# EAGLE design Sensor_AnalogVideo (EAGLE 9.6.2)
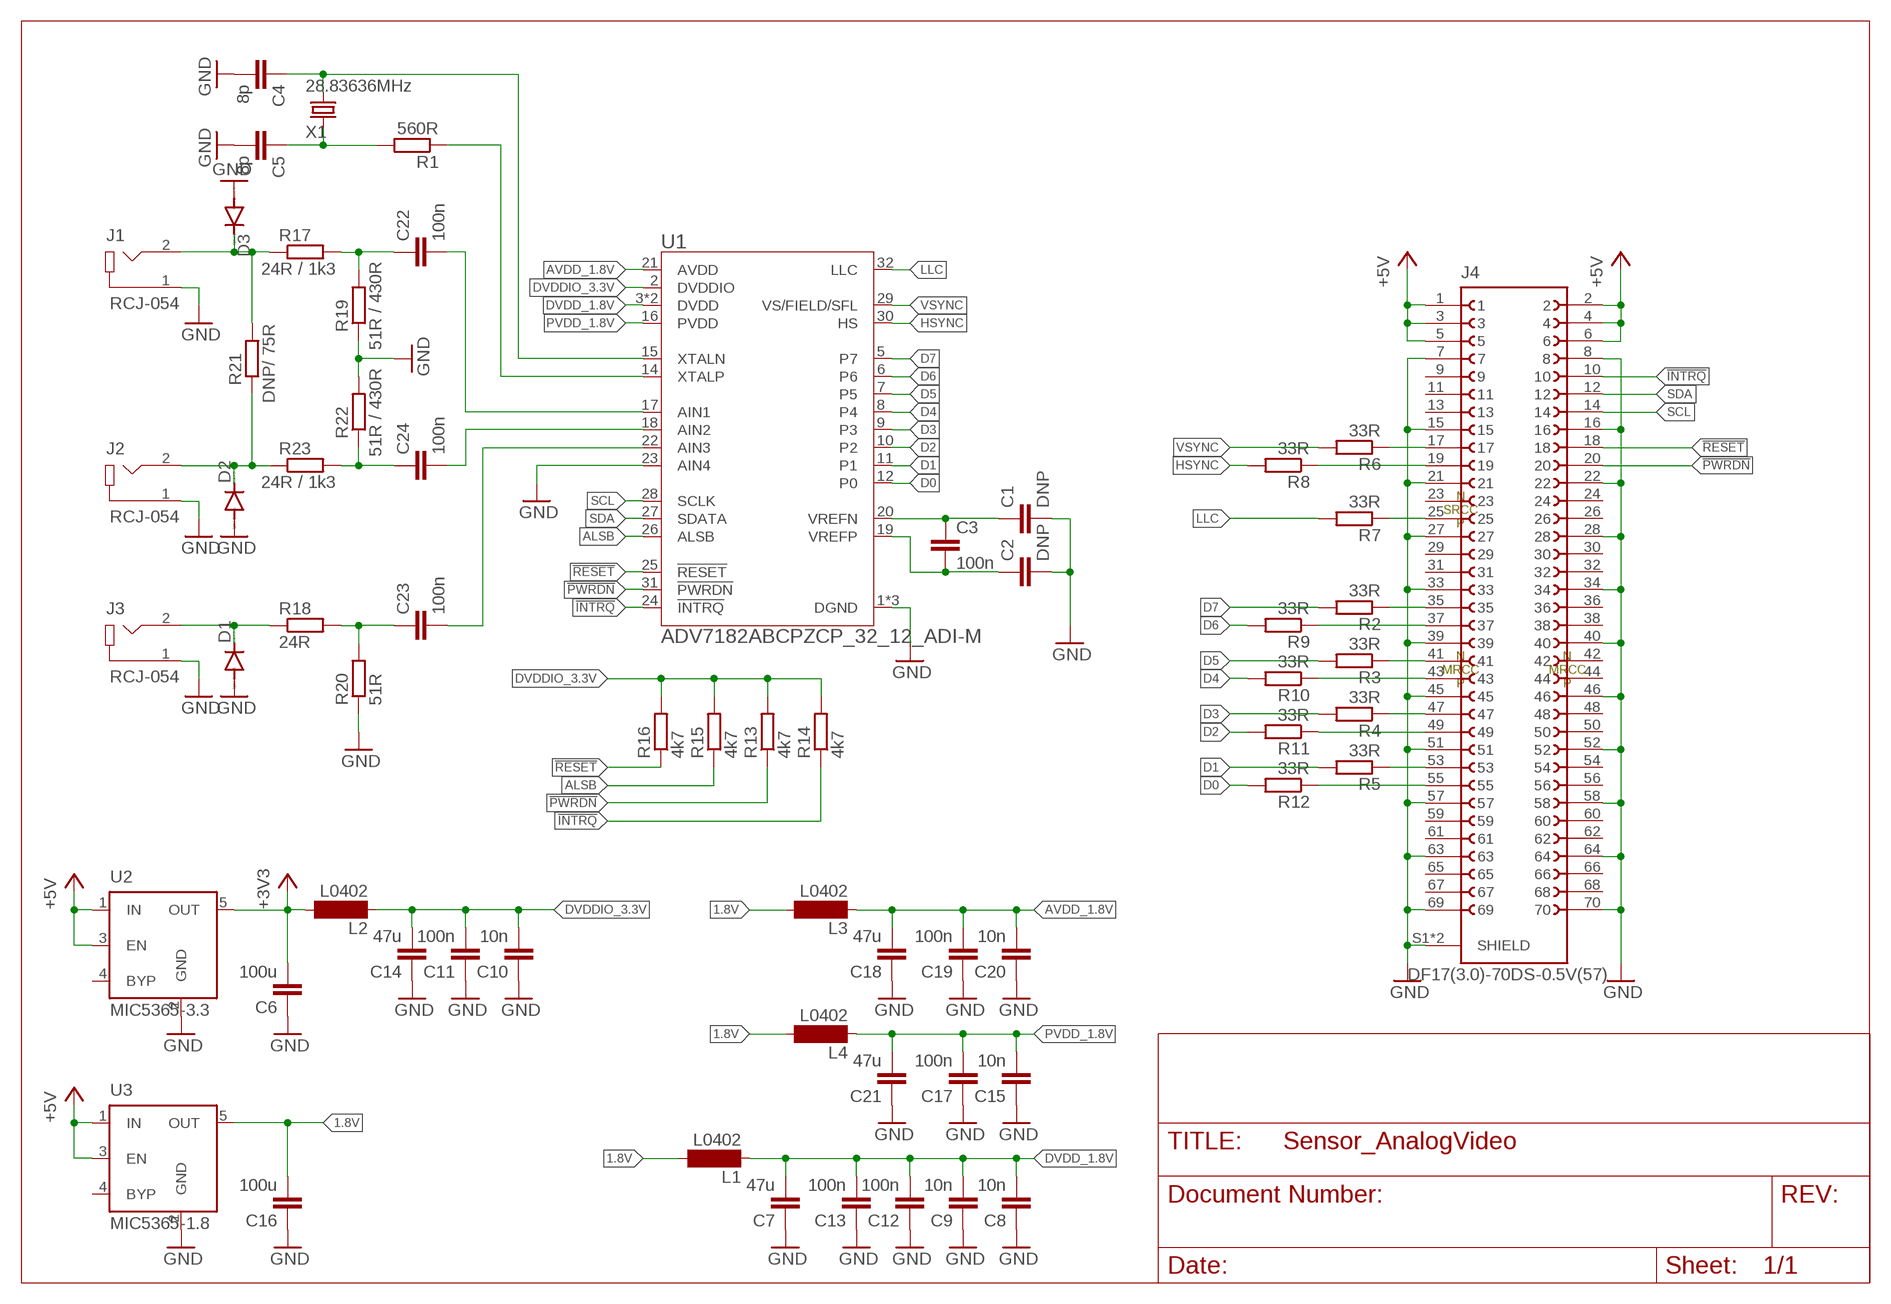
[diagram p0: schematic, sheet 1]

## Parts
C1  DNP  C-EUC0402  [C0402]
C2  DNP  C-EUC0402  [C0402]
C3  100n  C-EUC0402  [C0402]
C4  8p  C0402  [C0402]
C5  8p  C0402  [C0402]
C6  100u  C-EUC1206  [C1206]
C7  47u  C-EUC0805  [C0805]
C8  10n  C-EUC0402  [C0402]
C9  10n  C-EUC0402  [C0402]
C10  10n  C-EUC0402  [C0402]
C11  100n  C-EUC0402  [C0402]
C12  100n  C-EUC0402  [C0402]
C13  100n  C-EUC0402  [C0402]
C14  47u  C-EUC0805  [C0805]
C15  10n  C-EUC0402  [C0402]
C16  100u  C-EUC1206  [C1206]
C17  100n  C-EUC0402  [C0402]
C18  47u  C-EUC0805  [C0805]
C19  100n  C-EUC0402  [C0402]
C20  10n  C-EUC0402  [C0402]
C21  47u  C-EUC0805  [C0805]
C22  100n  C-EUC0402  [C0402]
C23  100n  C-EUC0402  [C0402]
C24  100n  C-EUC0402  [C0402]
D1  DIODE-SOD323-W  [SOD323-W]
D2  DIODE-SOD323-W  [SOD323-W]
D3  DIODE-SOD323-W  [SOD323-W]
J1  RCJ-054  [CUI_RCJ-054]
J2  RCJ-054  [CUI_RCJ-054]
J3  RCJ-054  [CUI_RCJ-054]
J4  DF17(3.0)-70DS-0.5V(57)  [DF17(3.0)-70DS-0.5V(57)]
L1  L0402  [C0402]
L2  L0402  [C0402]
L3  L0402  [C0402]
L4  L0402  [C0402]
R1  560R  R-EU_R0402  [R0402]
R2  33R  R-EU_R0402  [R0402]
R3  33R  R-EU_R0402  [R0402]
R4  33R  R-EU_R0402  [R0402]
R5  33R  R-EU_R0402  [R0402]
R6  33R  R-EU_R0402  [R0402]
R7  33R  R-EU_R0402  [R0402]
R8  33R  R-EU_R0402  [R0402]
R9  33R  R-EU_R0402  [R0402]
R10  33R  R-EU_R0402  [R0402]
R11  33R  R-EU_R0402  [R0402]
R12  33R  R-EU_R0402  [R0402]
R13  4k7  R-EU_R0402  [R0402]
R14  4k7  R-EU_R0402  [R0402]
R15  4k7  R-EU_R0402  [R0402]
R16  4k7  R-EU_R0402  [R0402]
R17  24R / 1k3  R-EU_R0603  [R0603]
R18  24R  R-EU_R0603  [R0603]
R19  51R / 430R  R-EU_R0603  [R0603]
R20  51R  R-EU_R0603  [R0603]
R21  DNP/ 75R  R-EU_R0603  [R0603]
R22  51R / 430R  R-EU_R0603  [R0603]
R23  24R / 1k3  R-EU_R0603  [R0603]
U1  ADV7182ABCPZCP_32_12_ADI-M  [CP_32_12_ADI-M]
U2  MIC5365-3.3  MIC5219XX  [SOT23-5]
U3  MIC5365-1.8  MIC5219XX  [SOT23-5]
X1  28.83636MHz  CRYSTAL-2520  [2520]

## Nets
1.8V: C16.1 L1.2 L3.2 L4.2 U3.5(OUT)
!INTRQ: J4.10 R14.1 U1.24(!INTRQ)
!PWRDN: J4.20 R13.1 U1.31(!PWRDN)
!RESET: J4.18 R16.1 U1.25(!RESET)
+3V3: C6.1 L2.2 U2.5(OUT)
+5V: J4.1 J4.2 J4.3 J4.4 J4.5 J4.6 U2.1(IN) U2.3(EN) U3.1(IN) U3.3(EN)
ALSB: R15.1 U1.26(ALSB)
AVDD_1.8V: C18.2 C19.2 C20.2 L3.1 U1.21(AVDD)
D0: R12.2 U1.12(P0)
D1: R5.2 U1.11(P1)
D2: R11.2 U1.10(P2)
D3: R4.2 U1.9(P3)
D4: R10.2 U1.8(P4)
D5: R3.2 U1.7(P5)
D6: R9.2 U1.6
D7: R2.2 U1.5(P7)
DVDD_1.8V: C7.2 C8.2 C9.2 C12.2 C13.2 L1.1 U1.3(DVDD) U1.13(DVDD)
DVDDIO_3.3V: C10.2 C11.2 C14.2 L2.1 R13.2 R14.2 R15.2 R16.2 U1.2(DVDDIO)
GND: C1.2 C2.2 C4.2 C5.2 C6.2 C7.1 C8.1 C9.1 C10.1 C11.1 C12.1 C13.1 C14.1 C15.1 C16.2 C17.1 C18.1 C19.1 C20.1 C21.1 D1.A D2.A D3.A J1.1 J2.1 J3.1 J4.7 J4.8 J4.15 J4.16 J4.21 J4.22 J4.27 J4.28 J4.33 J4.34 J4.39 J4.40 J4.45 J4.46 J4.51 J4.52 J4.57 J4.58 J4.63 J4.64 J4.69 J4.70 J4.S1(SHIELD) J4.S2(SHIELD) R19.1 R20.1 R22.2 U1.1(DGND) U1.4(DGND) U1.23(AIN4) U1.33(DGND) U2.2(GND) U3.2(GND)
HSYNC: R8.2 U1.30(HS)
LLC: R7.2 U1.32(LLC)
N$00001: C1.1 C3.1 U1.20(VREFN)
N$00002: C2.1 C3.2 U1.19(VREFP)
N$00003: D3.C J1.2 R17.1 R21.2
N$00004: D2.C J2.2 R21.1 R23.1
N$00005: C22.1 R17.2 R19.2
N$00006: C24.1 R22.1 R23.2
N$00007: C22.2 U1.17(AIN1)
N$00008: C24.2 U1.18(AIN2)
N$00009: D1.C J3.2 R18.1
N$00010: C23.2 U1.22(AIN3)
N$00011: C23.1 R18.2 R20.2
N$00012: J4.17 R6.1
N$00013: J4.19 R8.1
N$00014: J4.25 R7.1
N$00015: J4.35 R2.1
N$00016: J4.37 R9.1
N$00017: J4.41 R3.1
N$00018: J4.43 R10.1
N$00019: J4.47 R4.1
N$00020: J4.49 R11.1
N$00021: J4.53 R5.1
N$00022: J4.55 R12.1
N$00023: R1.1 U1.14(XTALP)
PVDD_1.8V: C15.2 C17.2 C21.2 L4.1 U1.16(PVDD)
SCL: J4.14 U1.28(SCLK)
SDA: J4.12 U1.27(SDATA)
VSYNC: R6.2 U1.29(VS/FIELD/SFL)
XTAL_IN: C4.1 U1.15(XTALN) X1.1
XTAL_OUT: C5.1 R1.2 X1.3
Unconnected: J4.9 J4.11 J4.13 J4.23 J4.24 J4.26 J4.29 J4.30 J4.31 J4.32 J4.36 J4.38 J4.42 J4.44 J4.48 J4.50 J4.54 J4.56 J4.59 J4.60 J4.61 J4.62 J4.65 J4.66 J4.67 J4.68 U2.4(BYP) U3.4(BYP)

## Notes on the sheet
- N
  SRCC
  P
- N
  MRCC
  P
- N
  MRCC
  P

## Library data of the parts
C1 C2 = rcl:C-EU: CAPACITOR, European symbol; SPICEPREFIX: C
C3 C11-C13 C17 C19 C22-C24 = rcl:C-EU: CAPACITOR, European symbol; LCSC: C1525; SPICEPREFIX: C
C4 C5 = misc:C; LCSC: C281765
C6 C16 = rcl:C-EU: CAPACITOR, European symbol; DIGIKEY: 490-GRM31CD80J107MEA8LCT-ND; LCSC: C15008; SPICEPREFIX: C
C7 C14 C18 C21 = rcl:C-EU: CAPACITOR, European symbol; LCSC: C77072
C8-C10 C15 C20 = rcl:C-EU: CAPACITOR, European symbol; LCSC: C15195; SPICEPREFIX: C
D1-D3 = diode:DIODE-: DIODE
J1-J3 = RCJ-054:RCJ-054; AVAILABILITY: Unavailable; CUI_PURCHASE_URL: https://www.cuidevices.com/product/interconnect/connectors/rca-connectors/rcj-05-series?utm_source=snapeda.com&utm_medium=referral&utm_campaign=snapedaBOM; DESCRIPTION: Metal Vertical RCA Jack, Yellow Housing and Insulator; DIGIKEY: CP-1427-ND; MF: CUI Devices; MP: RCJ-054; PACKAGE: None; PRICE: None
J4 = Hirose:DF17(3.0)-70DS-0.5V(57)
L1-L4 = misc:L; LCSC: C88970
R1-R12 R17-R23 = rcl:R-EU_: RESISTOR, European symbol; SPICEPREFIX: R
R13-R16 = rcl:R-EU_: RESISTOR, European symbol; LCSC: C25900; SPICEPREFIX: R
U1 = analog_devices:ADV7182ABCPZ: ADV7182A 10-Bit, SDTV Video Decoder with Differential Inputs; DATASHEET: https://www.analog.com/media/en/technical-documentation/data-sheets/ADV7182A.pdf; DESCRIPTION: 10-Bit, SDTV Video Decoder with Differential Inputs; DIGIKEY: 505-ADV7182ABCPZ-ND; MANUFACTURER_NAME: Analog Devices Inc; MPN: ADV7182ABCPZ
U2 = v-reg-micrel:MIC5219XX: VOLTAGE REGULATOR; DIGIKEY: 576-4085-1-ND; OC_FARNELL: unknown; OC_NEWARK: unknown
U3 = v-reg-micrel:MIC5219XX: VOLTAGE REGULATOR; DIGIKEY: 576-4082-1-ND; OC_FARNELL: unknown; OC_NEWARK: unknown
X1 = crystal:CRYSTAL: Crystal Resonator; DIGIKEY: XC3048CT-ND; LCSC: C24833836

## Board
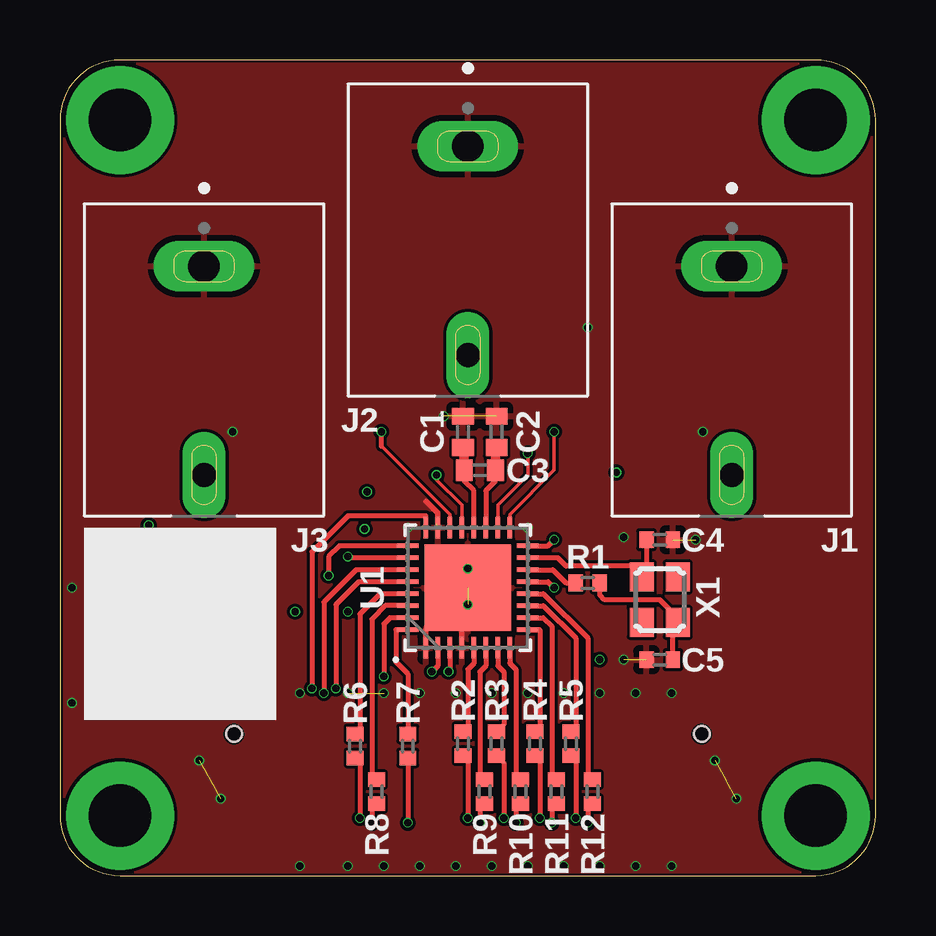
[diagram p1: board, top side]
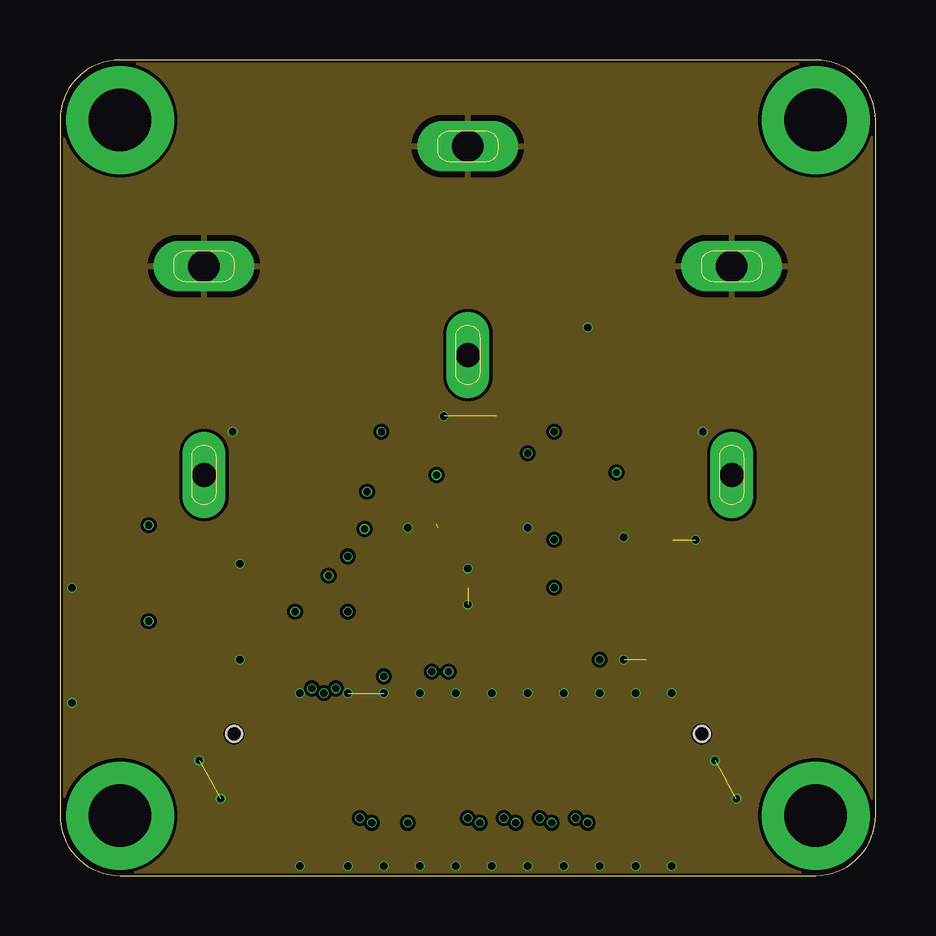
[diagram p2: board, inner layer Route2]
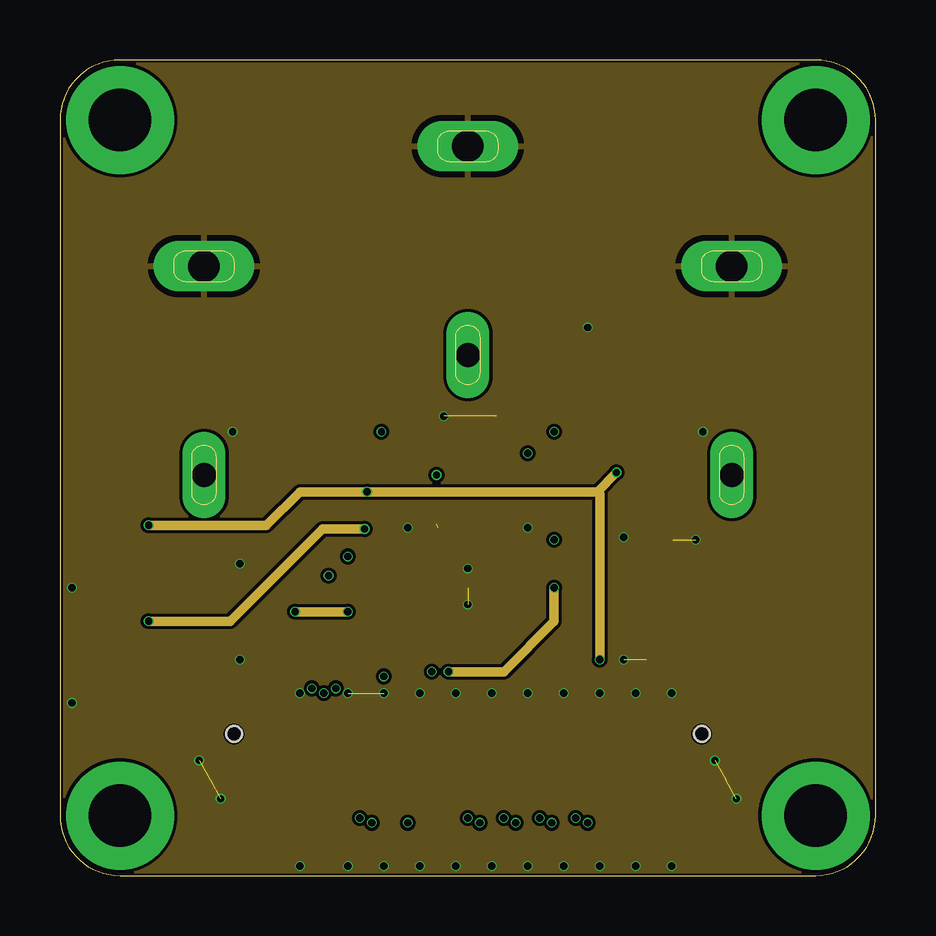
[diagram p3: board, inner layer Route15]
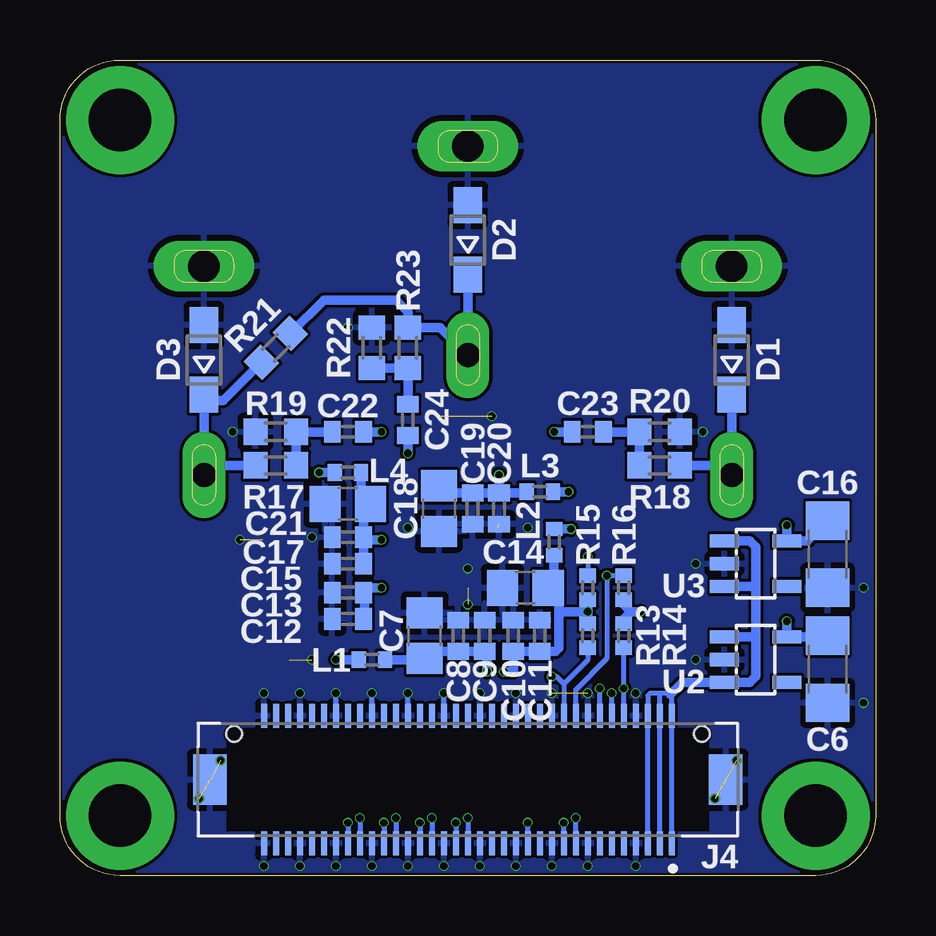
[diagram p4: board, bottom side, seen from below]

Size 34 x 34 mm. Coordinates in mm from the lower left corner, seen from the top.
Outline: 0,31.5 0,2.5 arc90 2.5,0 31.5,0 arc90 34,2.5 34,31.5 arc90 31.5,34 2.5,34 arc90 0,31.5
Copper layers (1*2*15*16): Top 0.035559375mm / dielectric 0.17018125mm / Route2 0.01778125mm / dielectric 47mil / Route15 0.01778125mm / dielectric 0.17018125mm / Bottom 0.035559375mm
Design rules "jlcpcb-4-layer *": minimum track width 5mil, minimum drill 0.2mm, track to track 5mil, track to pad 5mil, pad to pad 5mil, via to via 5mil, smd to smd 0mil, copper to edge 0.1mm, drill to drill 5mil, minimum pad ring 0.1mm, minimum via ring 0.05mm, stop-mask expansion 3mil, vias tented up to drill 100mil, thermal gap 10mil

### Footprints (pad centres in the part's own frame; a part is rotated, then mirrored left to right if it is on the bottom)
C0402 = smd 0.7 x 0.9: 1 -0.65,0; 2 0.65,0
C0402' = smd 0.6 x 0.7: 1 -0.55,0; 2 0.55,0
C1206 = smd 1.6 x 1.8: 1 -1.4,0; 2 1.4,0
C0805 = smd 1.3 x 1.5: 1 -0.95,0; 2 0.95,0
SOD323-W = smd 1.5 x 1.2: A 1.45,0; C -1.45,0
CUI_RCJ-054 = drill 1.3 pad 2.1 long: 1 0,-5.4 | drill 1 pad 1.8 long: 2 0,3.3
DF17(3.0)-70DS-0.5V(57) = smd 0.25 x 1: 1 -8.5,2.65; 2 -8.5,-2.65; 3 -8,2.65; 4 -8,-2.65; 5 -7.5,2.65; 6 -7.5,-2.65; 7 -7,2.65; 8 -7,-2.65; 9 -6.5,2.65; 10 -6.5,-2.65; 11 -6,2.65; 12 -6,-2.65; 13 -5.5,2.65; 14 -5.5,-2.65; 15 -5,2.65; 16 -5,-2.65; 17 -4.5,2.65; 18 -4.5,-2.65; 19 -4,2.65; 20 -4,-2.65; 21 -3.5,2.65; 22 -3.5,-2.65; 23 -3,2.65; 24 -3,-2.65; 25 -2.5,2.65; 26 -2.5,-2.65; 27 -2,2.65; 28 -2,-2.65; 29 -1.5,2.65; 30 -1.5,-2.65; 31 -1,2.65; 32 -1,-2.65; 33 -0.5,2.65; 34 -0.5,-2.65; 35 0,2.65; 36 0,-2.65; 37 0.5,2.65; 38 0.5,-2.65; 39 1,2.65; 40 1,-2.65; 41 1.5,2.65; 42 1.5,-2.65; 43 2,2.65; 44 2,-2.65; 45 2.5,2.65; 46 2.5,-2.65; 47 3,2.65; 48 3,-2.65; 49 3.5,2.65; 50 3.5,-2.65; 51 4,2.65; 52 4,-2.65; 53 4.5,2.65; 54 4.5,-2.65; 55 5,2.65; 56 5,-2.65; 57 5.5,2.65; 58 5.5,-2.65; 59 6,2.65; 60 6,-2.65; 61 6.5,2.65; 62 6.5,-2.65; 63 7,2.65; 64 7,-2.65; 65 7.5,2.65; 66 7.5,-2.65; 67 8,2.65; 68 8,-2.65; 69 8.5,2.65; 70 8.5,-2.65 | smd 1.4 x 2.1: S1 -10.75,0; S2 10.75,0 | hole 0.65: -9.75,-1.9; 9.75,-1.9
R0402 = smd 0.6 x 0.7: 1 -0.5,0; 2 0.5,0
R0603 = smd 1 x 1.1: 1 -0.85,0; 2 0.85,0
CP_32_12_ADI-M = smd 0.906 x 0.199: 1 -2.503,1.75; 2 -2.503,1.25; 3 -2.503,0.75; 4 -2.503,0.25; 5 -2.503,-0.25; 6 -2.503,-0.75; 7 -2.503,-1.25; 8 -2.503,-1.75; 17 2.503,-1.75; 18 2.503,-1.25; 19 2.503,-0.75; 20 2.503,-0.25; 21 2.503,0.25; 22 2.503,0.75; 23 2.503,1.25; 24 2.503,1.75 | smd 0.199 x 0.906: 9 -1.75,-2.503; 10 -1.25,-2.503; 11 -0.75,-2.503; 12 -0.25,-2.503; 13 0.25,-2.503; 14 0.75,-2.503; 15 1.25,-2.503; 16 1.75,-2.503; 25 1.75,2.503; 26 1.25,2.503; 27 0.75,2.503; 28 0.25,2.503; 29 -0.25,2.503; 30 -0.75,2.503; 31 -1.25,2.503; 32 -1.75,2.503 | smd 3.6 x 3.6: 33 0,0
SOT23-5 = smd 0.55 x 1.2: 1 -0.95,-1.3; 2 0,-1.3; 3 0.95,-1.3; 4 0.95,1.3; 5 -0.95,1.3
2520 = smd 1.2 x 1: 1 -0.95,-0.75; 2 0.95,-0.75; 3 0.95,0.75; 4 -0.95,0.75

### Placement (x,y rotation side)
C1  16.8,18.5 90 top
C2  18.2,18.5 90 top
C3  17.5,16.9 0 top
C4  8p  [C0402']  25,14 0 top
C5  8p  [C0402']  25,9 180 top
C6  2,8.6 270 bottom
C7  18.8,10 270 bottom
C8  17.4,10 270 bottom
C9  16.3,10 270 bottom
C10  15.1,10 270 bottom
C11  14,10 270 bottom
C12  22,10.7 0 bottom
C13  22,11.8 0 bottom
C14  14.6,12 0 bottom
C15  22,13 0 bottom
C16  2,13.4 270 bottom
C17  22,14.1 0 bottom
C18  18.2,15.3 90 bottom
C19  16.8,15.3 90 bottom
C20  15.7,15.3 90 bottom
C21  22,15.5 0 bottom
C22  22,18.5 0 bottom
C23  12,18.5 180 bottom
C24  19.5,19 270 bottom
D1  6,21.5 90 bottom
D2  17,26.5 90 bottom
D3  28,21.5 90 bottom
J1  28,20 180 top
J2  17,25 180 top
J3  6,20 180 top
J4  17,4 180 bottom
L1  L0402  [C0402']  21,9 180 bottom
L2  L0402  [C0402']  13.4,13.9 90 bottom
L3  L0402  [C0402']  14,16 0 bottom
L4  L0402  [C0402']  22,16.8 180 bottom
R1  22,12.2 0 top
R2  16.8,5.5 90 top
R3  18.2,5.5 90 top
R4  19.8,5.5 90 top
R5  21.3,5.5 90 top
R6  12.3,5.4 90 top
R7  14.5,5.4 90 top
R8  13.2,3.5 90 top
R9  17.7,3.5 90 top
R10  19.2,3.5 90 top
R11  20.7,3.5 90 top
R12  22.2,3.5 90 top
R13  12,10 90 bottom
R14  10.5,10 90 bottom
R15  12,12 270 bottom
R16  10.5,12 270 bottom
R17  25,17.1 0 bottom
R18  9,17.1 180 bottom
R19  25,18.5 0 bottom
R20  9,18.5 180 bottom
R21  25,22 225 bottom
R22  21,22 90 bottom
R23  19.5,22 270 bottom
U1  17,12 90 top
U2  5,9 270 bottom
U3  5,13 270 bottom
X1  25,11.5 270 top

### Tracks (layer width: path | path; a pad name or v marks a point on that pad's centre or on a via)
1.8V  (via drill 0.3)
  Route15 0.4: v3.7,14.6 8.6,14.6 10,16 v12.8,16 22.4,16 | 22.4,16 v23.2,16.8 | v22.5,9 22.5,15.9 22.4,16
  Bottom 0.4: C16.1 2.85,13.95 U3.5 v3.7,14.6 | v3.7,14.6 | v22.5,9 L1.2 | v23.2,16.8 L4.2 | v12.8,16 L3.2
!INTRQ  (via drill 0.3)
  Top 0.2: U1.24 15.25,15 12,15 10.5,13.5 v10.5,7.8
  Bottom 0.2: J4.10 v10.5,7.8 R14.1
!PWRDN  (via drill 0.3)
  Top 0.2: U1.31 13.75,10.75 13.5,10.5 v13.5,8.3
  Bottom 0.2: R13.1 12,9 13,8 | 13,8 J4.20 | 13,8 13.3,8.3 v13.5,8.3
!RESET  (via drill 0.3)
  Top 0.2: U1.25 11.65,13.75 11.2,13.3 v11.2,12.5
  Bottom 0.2: J4.18 12.5,7.75 11.2,9.05 v11.2,12.5 R16.1
+3V3  (via drill 0.3)
  Route15 0.4: v3.7,10.6 7.1,10.6 10.95,14.45 v12.7,14.45
  Bottom 0.4: C6.1 2.05,9.95 U2.5 v3.7,10.6 | v3.7,10.6 | v12.7,14.45 L2.2
+5V
  Bottom 0.2: J4.1 J4.2 8.5,7.5 8.55,7.55 8.6,7.6 9,7.6 | J4.3 J4.4 9,7.6 | J4.5 J4.6 9.5,7.5 9.4,7.6 9,7.6
  Bottom 0.4: 8.55,7.55 8.05,8.05 U2.3 5.25,8.05 5,8.3 5,10 | U3.1 5.25,13.95 5,13.7 5,12 | 5,10 5,12 | U3.3 5.05,12.05 5,12 | U2.1 5.05,9.95 5,10
ALSB  (via drill 0.3)
  Top 0.2: U1.26 12.05,13.25 v12,13.3
  Bottom 0.2: v12,13.3 R15.1
AVDD_1.8V  (via drill 0.3)
  Top 0.15: U1.21 16.75,15.45 15.7,16.5 v15.7,16.7
  Bottom 0.4: C20.2 v15.7,16.7 | C20.2 C19.2 17.9,15.95 C18.2 | C20.2 14.6,15.95 L3.1
D0
  Top 0.15: 22,4.2 R12.2
  Top 0.2: U1.12 20.15,11.75 22,9.9 22,4.2
D1
  Top 0.15: 21.5,6.2 R5.2
  Top 0.2: U1.11 20.15,11.25 21.5,9.9 21.5,6.2
D2
  Top 0.15: 20.5,4.2 R11.2
  Top 0.2: U1.10 20.15,10.75 20.5,10.4 20.5,4.2
D3
  Top 0.15: 20,6.2 R4.2
  Top 0.2: U1.9 20,10.25 20,6.2
D4
  Top 0.15: 19,4.2 R10.2
  Top 0.2: U1.8 18.75,8.85 19,8.6 19,4.2
D5
  Top 0.15: 18.5,6.3 R3.2
  Top 0.2: U1.7 18.25,8.75 18.5,8.5 18.5,6.3
D6
  Top 0.15: 17.5,4.2 R9.2
  Top 0.2: U1.6 17.75,8.75 17.5,8.5 17.5,4.2
D7
  Top 0.15: 17,6.2 R2.2
  Top 0.2: U1.5 17.25,8.85 17,8.6 17,6.2
DVDD_1.8V  (via drill 0.3)
  Top 0.2: U1.13 20.35,12.25 v20.6,12 | v16.2,8.5 16.25,8.55 U1.3
  Route15 0.4: v16.2,8.5 18.5,8.5 20.6,10.6 v20.6,12
  Bottom 0.4: v16.2,8.5 16.2,9.25 C9.2 C8.2 18.5,9.35 C7.2 18.85,9 L1.1 | v20.6,12 21.3,12 21.3,11.8 | 21.3,11.8 C13.2 | C12.2 21.3,10.75 21.3,11.8
DVDDIO_3.3V  (via drill 0.3)
  Top 0.2: U1.2 15.75,8.75 v15.5,8.5
  Route15 0.4: v12,11 v9.8,11
  Bottom 0.4: R13.2 v12,11 | v12,11 R15.2 | v15.5,8.5 15.1,8.5 C10.2 C11.2 13.35,9.35 13.2,9.5 13.2,11 | R16.2 10.5,11.3 10.2,11 | R14.2 10.5,10.7 10.2,11 | v9.8,11 10.2,11 | L2.1 13.4,12.25 13.57,12.07 | 13.57,12.07 C14.2 | 13.57,12.07 13.2,11.7 13.2,11 | v12,11 13.2,11
GND  (via drill 0.3)  (11 unrouted)
  Top 0.2: U1.4 16.75,11.75 | 16.75,11.75 U1.33 | U1.1 15.25,10.25 16.75,11.75 | U1.23 15.75,15.1 15.25,15.6
  Bottom 0.2: J4.40 v18,7.6 | J4.46 v19.5,7.6 | J4.52 v21,7.6 | J4.58 v22.5,7.6
  other vias: 24,7.6 16.5,7.6 15,0.4 16.5,0.4 18,0.4 19.5,0.4 21,0.4 22.5,0.4 24,0.4 5.8,4.8 6.7,3.2 27.3,4.8 28.2,3.2 15,7.6 13.5,7.6 12,7.6 13.5,0.4 12,0.4 10,0.4 10,7.6 25.5,7.6 25.5,0.4 17,12.8 17,11.3 7.2,18.5 22,22.85 26.8,18.5 26.5,14 23.5,9 7.5,9 7.5,13 0.5,12 0.5,7.2 16,19.15 23.5,14.1 14.5,14.5 19.5,14.5
  pour Top: 0,0 34,0 34,34 0,34
  pour Bottom: 0,0 34,0 34,34 0,34
  pour Route15: 0,0 34,0 34,34 0,34
  pour Route2: 0,0 34,0 34,34 0,34
HSYNC
  Top 0.15: U1.30 | 13,4.2 R8.2
  Top 0.2: U1.30 13.56,11.25 13,10.69 13,4.2
LLC
  Top 0.2: U1.32 14,10.25 14,8.9 14.5,8.4 R7.2
N$00001
  Top 0.2: U1.20 17.25,16.05 16.85,16.45 C3.1
  Top 0.4: C1.1 16.85,17.8 C3.1
N$00002
  Top 0.2: U1.19 17.75,16.05 18.15,16.45 C3.2
  Top 0.4: C2.1 18.15,17.8 C3.2
N$00003
  Bottom 0.4: R17.1 27.6,17.1 J1.2 28,19.8 | 28,19.8 D3.C | R21.2 27.2,19.8 28,19.8
N$00004
  Bottom 0.4: R21.1 23,24 20,24 19.5,23.5 R23.1 18.15,22.85 J2.2 D2.C
N$00005
  Bottom 0.4: R17.2 R19.2 C22.1
N$00006
  Bottom 0.4: R22.1 R23.2 C24.1
N$00007  (via drill 0.3)
  Top 0.15: U1.17 18.75,15.05 20.6,16.9 v20.6,18.5
  Bottom 0.4: C22.2 v20.6,18.5
N$00008  (via drill 0.3)
  Top 0.15: U1.18 18.25,15.45 19.5,16.7 v19.5,17.6
  Bottom 0.4: C24.2 v19.5,17.6
N$00009
  Bottom 0.4: R18.1 6.4,17.1 J3.2 D1.C
N$00010  (via drill 0.3)
  Top 0.15: U1.22 16.25,15.05 13.4,17.9
  Top 0.2: 13.4,17.9 v13.4,18.5
  Bottom 0.4: C23.2 v13.4,18.5
N$00011
  Bottom 0.4: R18.2 R20.2 C23.1
N$00012  (via drill 0.3)
  Top 0.15: R6.1 12.5,4.7
  Top 0.2: 12.5,4.7 v12.5,2.4
  Bottom 0.2: J4.17 v12.5,2.4
N$00013  (via drill 0.3)
  Top 0.15: R8.1 13,2.8
  Top 0.2: 13,2.8 v13,2.2
  Bottom 0.2: J4.19 v13,2.2
N$00014  (via drill 0.3)
  Top 0.2: R7.1 v14.5,2.2
  Bottom 0.152: J4.25 14.5,1.77
  Bottom 0.2: J4.25 v14.5,2.2
N$00015  (via drill 0.3)
  Top 0.15: R2.1 17,4.8
  Top 0.2: 17,4.8 v17,2.4
  Bottom 0.2: v17,2.4 J4.35
N$00016  (via drill 0.3)
  Top 0.15: R9.1 17.5,2.8
  Top 0.2: 17.5,2.8 v17.5,2.2
  Bottom 0.2: v17.5,2.2 J4.37
N$00017  (via drill 0.3)
  Top 0.15: R3.1 18.5,4.7
  Top 0.2: 18.5,4.7 v18.5,2.4
  Bottom 0.2: v18.5,2.4 J4.41
N$00018  (via drill 0.3)
  Top 0.15: R10.1 19,2.8
  Top 0.2: 19,2.8 v19,2.2
  Bottom 0.2: v19,2.2 J4.43
N$00019  (via drill 0.3)
  Top 0.15: R4.1 20,4.8
  Top 0.2: 20,4.8 v20,2.4
  Bottom 0.2: v20,2.4 J4.47
N$00020  (via drill 0.3)
  Top 0.15: R11.1 20.5,2.8
  Top 0.2: 20.5,2.8 v20.5,2.2
  Bottom 0.2: v20.5,2.2 J4.49
N$00021  (via drill 0.3)
  Top 0.15: R5.1 21.5,4.8
  Top 0.2: 21.5,4.8 v21.5,2.4
  Bottom 0.2: v21.5,2.4 J4.53
N$00022  (via drill 0.3)
  Top 0.15: R12.1 22,2.8
  Top 0.2: 22,2.8 v22,2.2
  Bottom 0.2: v22,2.2 J4.55
N$00023
  Top 0.2: U1.14 20.55,12.75 21.1,12.2 R1.1
N$00025  (via drill 2.6 pad 4.5)
  other vias: 2.5,31.5
N$00026  (via drill 2.6 pad 4.5)
  other vias: 31.5,31.5
N$00027  (via drill 2.6 pad 4.5)
  other vias: 2.5,2.5
N$00028  (via drill 2.6 pad 4.5)
  other vias: 31.5,2.5
PVDD_1.8V  (via drill 0.3)
  Top 0.2: U1.16 20.35,13.75 v20.6,14
  Bottom 0.4: C17.2 21.25,14 v20.6,14 | C17.2 C15.2 | C17.2 21.35,15.2 C21.2 21.45,15.9 L4.1
SCL  (via drill 0.3)
  Top 0.2: U1.28 12.45,12.25 11.5,11.3 v11.5,7.8
  Bottom 0.2: J4.14 v11.5,7.8
SDA  (via drill 0.3)
  Top 0.2: U1.27 12.35,12.75 11,11.4 v11,7.6
  Bottom 0.2: J4.12 v11,7.6
VSYNC
  Top 0.15: 12.5,5.9 R6.2
  Top 0.2: U1.29 13.35,11.75 12.5,10.9 12.5,5.9
XTAL_IN
  Top 0.2: U1.15 20.75,13.25 21.1,12.9 23.8,12.9 X1.1 24.45,12.65 C4.1
XTAL_OUT
  Top 0.2: R1.2 22.5,11.7 22.7,11.5 25,11.5 25.75,10.75 X1.3 25.55,10.35 C5.1

### Text on the board
tStop: Pr/C | Pb | CVBS/Y